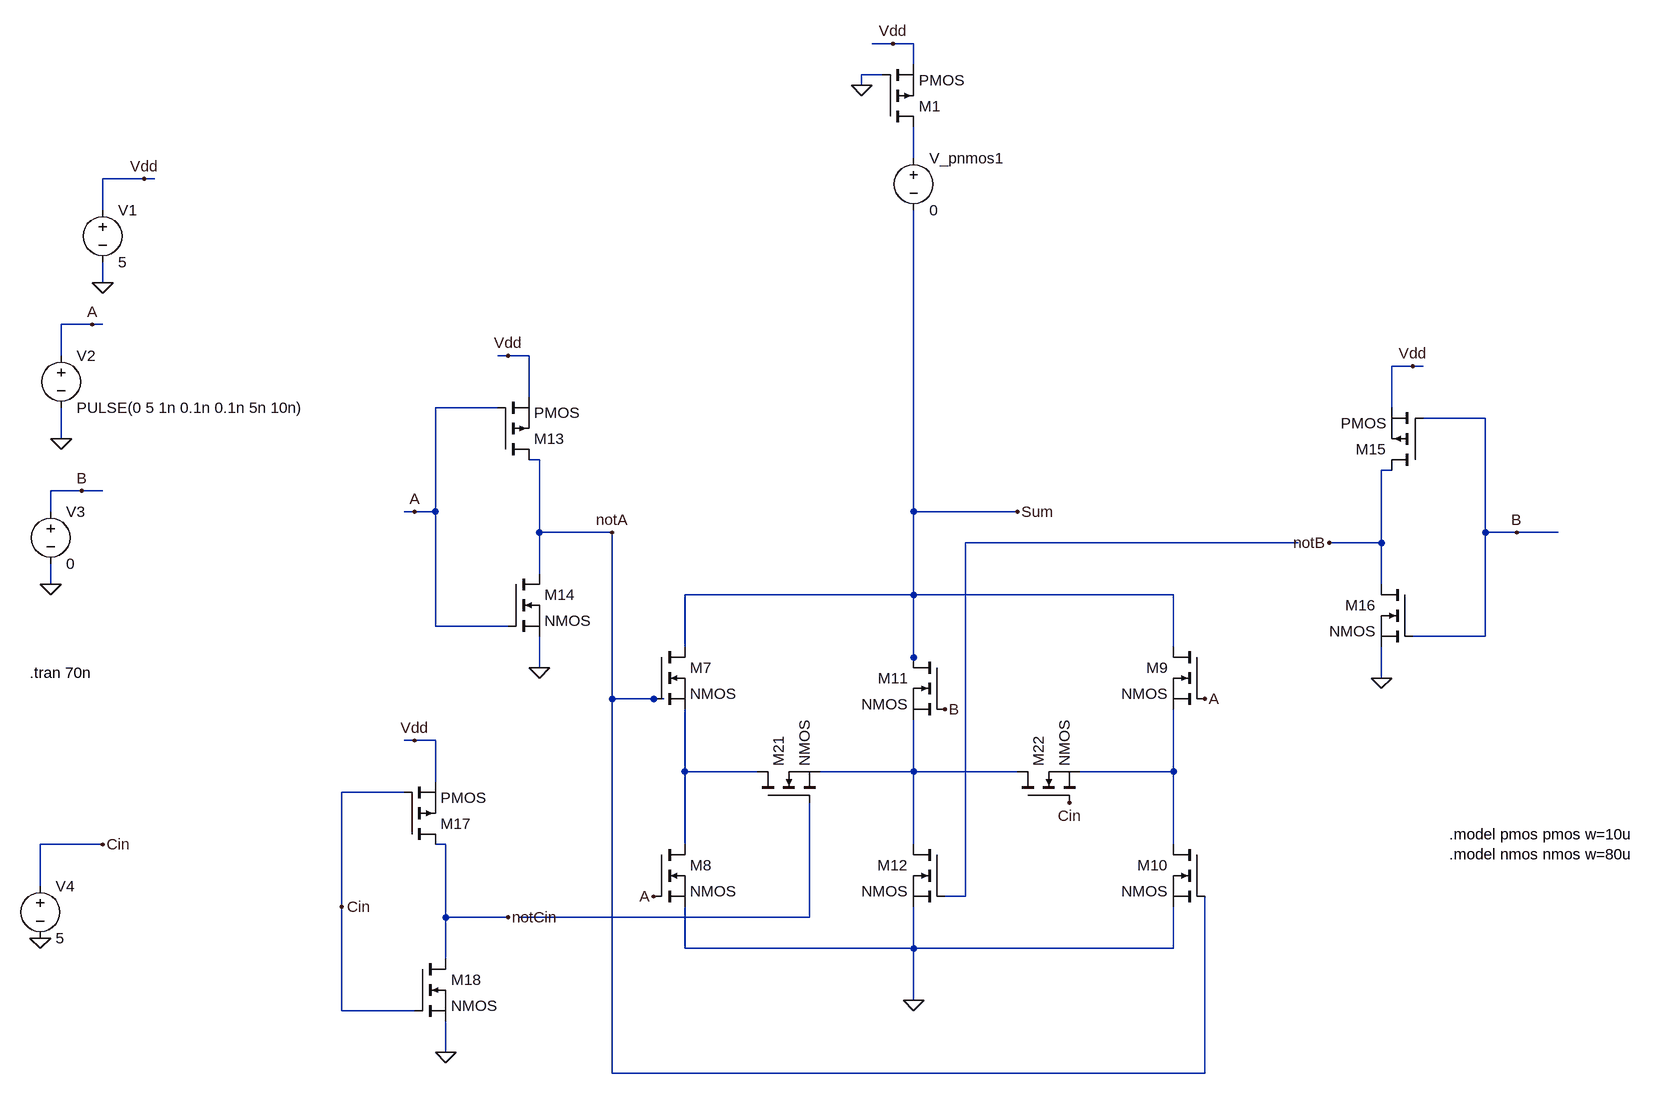
[diagram p0: schematic Sum2.asc]
Sum2.asc, the LTspice schematic file:
Version 4
SHEET 1 1260 836
WIRE 16 -752 -16 -752
WIRE 48 -752 16 -752
WIRE 48 -720 48 -752
WIRE 0 -704 -32 -704
WIRE -32 -688 -32 -704
WIRE 48 -576 48 -624
WIRE -1136 -544 -1200 -544
WIRE -1120 -544 -1136 -544
WIRE -1200 -496 -1200 -544
WIRE -1200 -384 -1200 -416
WIRE -1216 -320 -1264 -320
WIRE -1200 -320 -1216 -320
WIRE -1264 -272 -1264 -320
WIRE -576 -272 -592 -272
WIRE -544 -272 -576 -272
WIRE 816 -256 784 -256
WIRE 832 -256 816 -256
WIRE -544 -208 -544 -272
WIRE -592 -192 -688 -192
WIRE 784 -192 784 -256
WIRE 928 -176 832 -176
WIRE -1264 -144 -1264 -192
WIRE -528 -112 -544 -112
WIRE 784 -96 768 -96
WIRE -1232 -64 -1280 -64
WIRE -1200 -64 -1232 -64
WIRE -1280 -32 -1280 -64
WIRE -720 -32 -736 -32
WIRE -688 -32 -688 -192
WIRE -688 -32 -720 -32
WIRE 48 -32 48 -496
WIRE 208 -32 48 -32
WIRE -528 0 -528 -112
WIRE -416 0 -528 0
WIRE 928 0 928 -176
WIRE 976 0 928 0
WIRE 1040 0 976 0
WIRE 640 16 128 16
WIRE 768 16 768 -96
WIRE 768 16 688 16
WIRE -528 64 -528 0
WIRE -1280 80 -1280 48
WIRE 768 80 768 16
WIRE 48 96 48 -32
WIRE 48 96 -304 96
WIRE 448 96 48 96
WIRE -688 144 -688 -32
WIRE -576 144 -688 144
WIRE 928 160 928 0
WIRE 928 160 816 160
WIRE -304 176 -304 96
WIRE 448 176 448 96
WIRE 48 192 48 96
WIRE -528 208 -528 160
WIRE 48 208 48 192
WIRE 768 224 768 176
WIRE -416 256 -416 0
WIRE -352 256 -416 256
WIRE -336 256 -352 256
WIRE -720 320 -736 320
WIRE -688 320 -720 320
WIRE -304 368 -304 272
WIRE -192 368 -304 368
WIRE 48 368 48 288
WIRE 48 368 -96 368
WIRE 208 368 48 368
WIRE 448 368 448 272
WIRE 448 368 304 368
WIRE -688 384 -688 320
WIRE -736 400 -832 400
WIRE -1200 480 -1296 480
WIRE -672 480 -688 480
WIRE -304 480 -304 368
WIRE 48 480 48 368
WIRE 448 480 448 368
WIRE -1296 544 -1296 480
WIRE 128 560 128 16
WIRE 128 560 96 560
WIRE -832 576 -832 400
WIRE -672 592 -672 480
WIRE -576 592 -672 592
WIRE -112 592 -112 416
WIRE -112 592 -560 592
WIRE -304 640 -304 576
WIRE 48 640 48 576
WIRE 48 640 -304 640
WIRE 448 640 448 576
WIRE 448 640 48 640
WIRE -672 656 -672 592
WIRE 48 720 48 640
WIRE -832 736 -832 576
WIRE -720 736 -832 736
WIRE -672 800 -672 752
WIRE -416 832 -416 256
WIRE 496 832 496 560
WIRE 496 832 -416 832
FLAG -1200 -384 0
FLAG -1136 -544 Vdd
FLAG -1264 -144 0
FLAG -1280 80 0
FLAG -1216 -320 A
FLAG -1232 -64 B
FLAG -528 208 0
FLAG -576 -272 Vdd
FLAG -720 -32 A
FLAG -416 0 notA
FLAG 768 224 0
FLAG 816 -256 Vdd
FLAG 976 0 B
FLAG 688 16 notB
FLAG -352 560 A
FLAG 496 256 A
FLAG 96 272 B
FLAG -1296 624 0
FLAG -1200 480 Cin
FLAG -672 800 0
FLAG -720 320 Vdd
FLAG -832 576 Cin
FLAG -576 592 notCin
FLAG 208 -32 Sum
FLAG 288 416 Cin
FLAG 48 720 0
FLAG 16 -752 Vdd
FLAG -32 -688 0
SYMBOL voltage -1200 -512 R0
WINDOW 123 0 0 Left 2
WINDOW 39 0 0 Left 2
SYMATTR InstName V1
SYMATTR Value 5
SYMBOL voltage -1264 -288 R0
WINDOW 123 0 0 Left 2
WINDOW 39 0 0 Left 2
SYMATTR InstName V2
SYMATTR Value PULSE(0 5 1n 0.1n 0.1n 5n 10n)
SYMBOL voltage -1280 -48 R0
WINDOW 123 0 0 Left 2
WINDOW 39 0 0 Left 2
SYMATTR InstName V3
SYMATTR Value 0
SYMBOL nmos -352 176 R0
SYMATTR InstName M7
SYMBOL nmos -352 480 R0
SYMATTR InstName M8
SYMBOL nmos 496 176 M0
SYMATTR InstName M9
SYMBOL nmos 496 480 M0
SYMATTR InstName M10
SYMBOL nmos 96 192 M0
SYMATTR InstName M11
SYMBOL nmos 96 480 M0
SYMATTR InstName M12
SYMBOL pmos -592 -112 M180
SYMATTR InstName M13
SYMBOL nmos -576 64 R0
SYMATTR InstName M14
SYMBOL pmos 832 -96 R180
SYMATTR InstName M15
SYMBOL nmos 816 80 M0
SYMATTR InstName M16
SYMBOL voltage -1296 528 R0
WINDOW 123 0 0 Left 0
WINDOW 39 0 0 Left 0
SYMATTR InstName V4
SYMATTR Value 5
SYMBOL pmos -736 480 M180
SYMATTR InstName M17
SYMBOL nmos -720 656 R0
SYMATTR InstName M18
SYMBOL nmos -192 416 R270
SYMATTR InstName M21
SYMBOL nmos 208 416 R270
SYMATTR InstName M22
SYMBOL voltage 48 -592 R0
WINDOW 123 0 0 Left 2
WINDOW 39 0 0 Left 2
SYMATTR InstName V_pnmos1
SYMATTR Value 0
SYMBOL pmos 0 -624 M180
SYMATTR InstName M1
TEXT -1312 216 Left 2 !.tran 70n
TEXT 872 464 Left 2 !.model pmos pmos w=10u\n.model nmos nmos w=80u

The netlist it stands for:
* Sum2.asc
V1 Vdd 0 5
V2 A 0 PULSE(0 5 1n 0.1n 0.1n 5n 10n)
V3 B 0 0
M7 Sum notA N003 N003 NMOS
M8 N003 A 0 0 NMOS
M9 Sum A N005 N005 NMOS
M10 N005 notA 0 0 NMOS
M11 Sum B N004 N004 NMOS
M12 N004 N002 0 0 NMOS
M13 notA A Vdd Vdd PMOS
M14 notA A 0 0 NMOS
M15 notB B Vdd Vdd PMOS
M16 notB B 0 0 NMOS
V4 Cin 0 5
M17 notCin Cin Vdd Vdd PMOS
M18 notCin Cin 0 0 NMOS
M21 N003 N006 N004 N004 NMOS
M22 N004 Cin N005 N005 NMOS
V_pnmos1 N001 Sum 0
M1 N001 0 Vdd Vdd PMOS
.model NMOS NMOS
.model PMOS PMOS
.lib standard.mos
.tran 70n
.model pmos pmos w=10u
.model nmos nmos w=80u
.backanno
.end